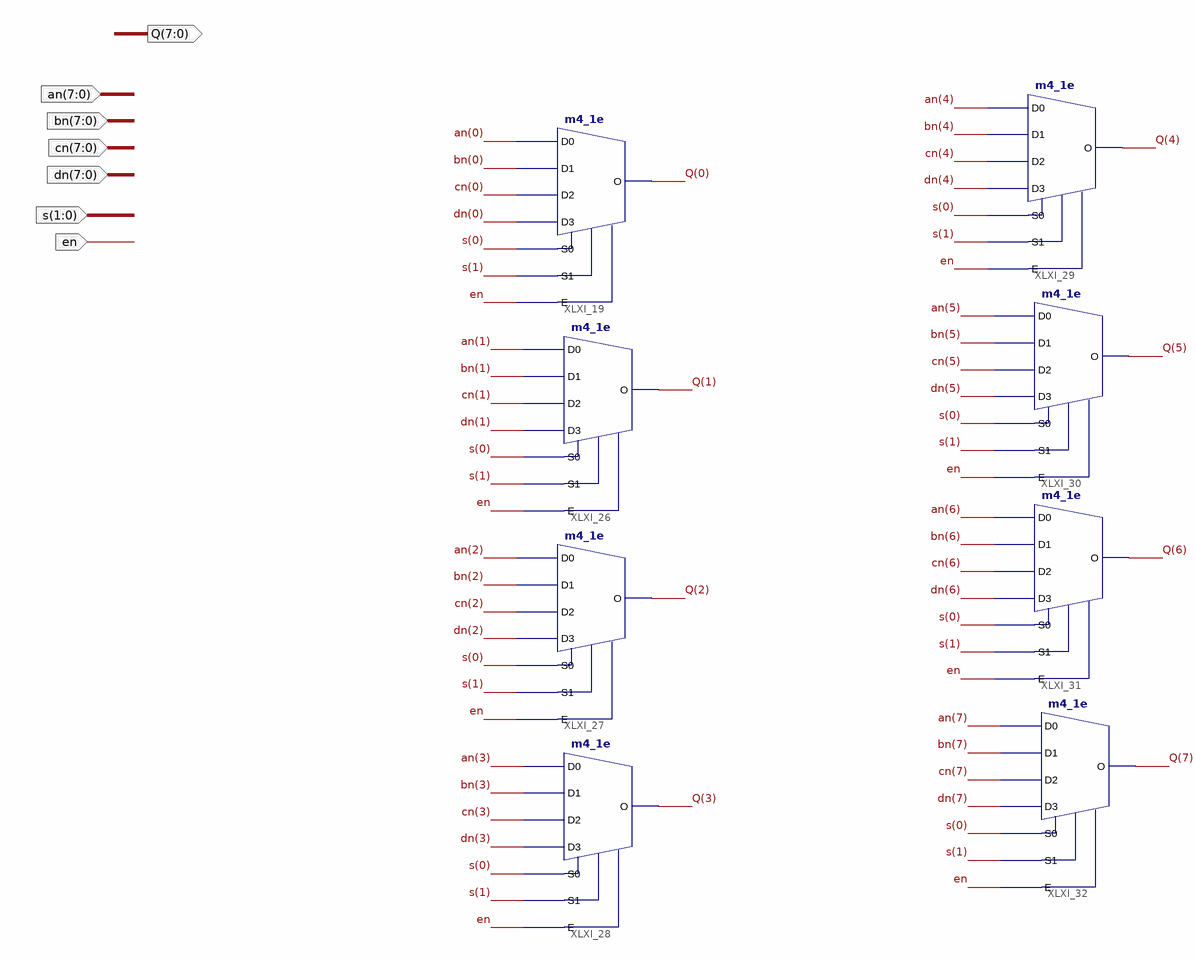
[diagram p0: schematic sheet 1]
// Xilinx ISE schematic Bytex4MUX.sch (spartan3e) as structural Verilog: 8 symbols, 7 ports
module Bytex4MUX (
  input  [7:0] bn,
  input  [7:0] an,
  input  [7:0] cn,
  input  [7:0] dn,
  input  en,
  input  [1:0] s,
  output [7:0] Q
);

  m4_1e XLXI_19 (.D0(an[0]), .D1(bn[0]), .D2(cn[0]), .D3(dn[0]), .E(en), .S0(s[0]), .S1(s[1]), .O(Q[0]));
  m4_1e XLXI_26 (.D0(an[1]), .D1(bn[1]), .D2(cn[1]), .D3(dn[1]), .E(en), .S0(s[0]), .S1(s[1]), .O(Q[1]));
  m4_1e XLXI_27 (.D0(an[2]), .D1(bn[2]), .D2(cn[2]), .D3(dn[2]), .E(en), .S0(s[0]), .S1(s[1]), .O(Q[2]));
  m4_1e XLXI_28 (.D0(an[3]), .D1(bn[3]), .D2(cn[3]), .D3(dn[3]), .E(en), .S0(s[0]), .S1(s[1]), .O(Q[3]));
  m4_1e XLXI_29 (.D0(an[4]), .D1(bn[4]), .D2(cn[4]), .D3(dn[4]), .E(en), .S0(s[0]), .S1(s[1]), .O(Q[4]));
  m4_1e XLXI_30 (.D0(an[5]), .D1(bn[5]), .D2(cn[5]), .D3(dn[5]), .E(en), .S0(s[0]), .S1(s[1]), .O(Q[5]));
  m4_1e XLXI_31 (.D0(an[6]), .D1(bn[6]), .D2(cn[6]), .D3(dn[6]), .E(en), .S0(s[0]), .S1(s[1]), .O(Q[6]));
  m4_1e XLXI_32 (.D0(an[7]), .D1(bn[7]), .D2(cn[7]), .D3(dn[7]), .E(en), .S0(s[0]), .S1(s[1]), .O(Q[7]));
endmodule
